# EAGLE design PCB-SLIDER60 (EAGLE 6.4)
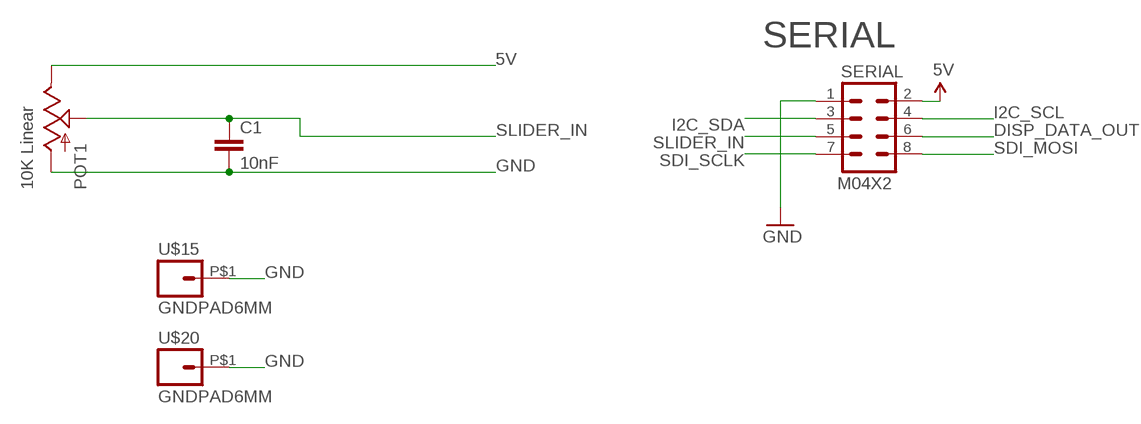
[diagram p0: schematic, sheet 1]

## Parts
C1  10nF  CAP0603-CAP  [0603-CAP]
POT1  10K Linear  SLIDER60  [SLIDER60]
SERIAL  M04X2  [2X4]
U$15  GNDPAD6MM  [3.2MMPAD6MM]
U$20  GNDPAD6MM  [3.2MMPAD6MM]

## Nets
5V [Power]: POT1.1(E) SERIAL.2
DISP_DATA_OUT: SERIAL.6
GND [Power]: C1.2 POT1.3(A) SERIAL.1 U$15.P$1 U$20.P$1
I2C_SCL: SERIAL.4
I2C_SDA: SERIAL.3
SDI_MOSI: SERIAL.8
SDI_SCLK: SERIAL.7
SLIDER_IN: C1.1 POT1.2A(S) SERIAL.5

## Notes on the sheet
- SERIAL

## Library data of the parts
C1 = SparkFun:CAP: Capacitor Standard 0603 ceramic capacitor, and 0.1" leaded capacitor.
POT1 = SKAARHOJ:SLIDER
SERIAL = SparkFun:M04X2
U$15 U$20 = SKAARHOJ:GNDPAD

## Net classes
0 default: width 0.203 mm, drill 0.406 mm, clearance 0.203 mm
1 Power: width 0.406 mm, drill 0.61 mm, clearance 0.203 mm

## Board
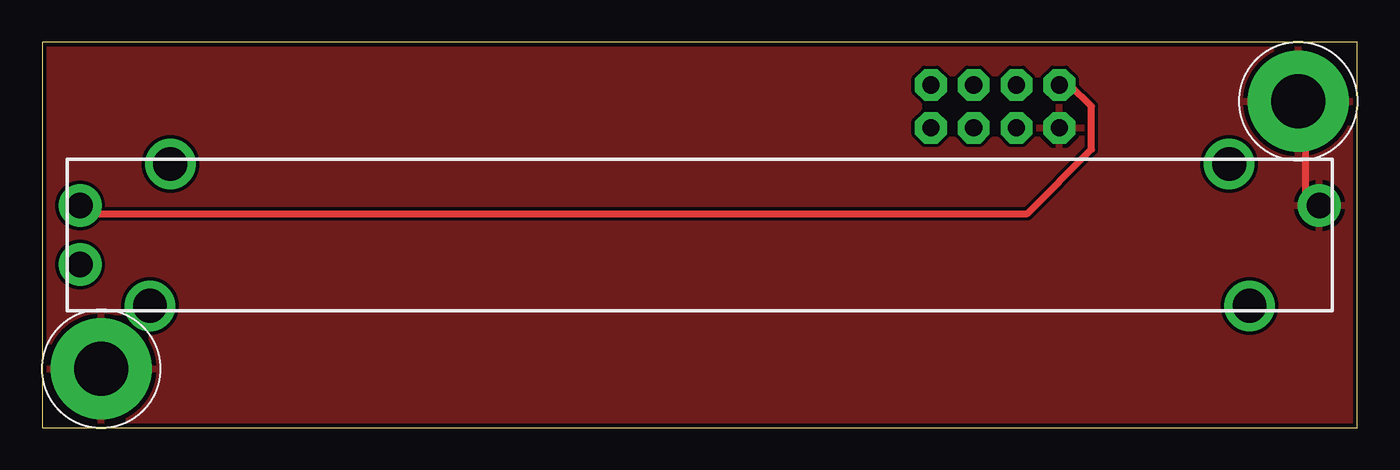
[diagram p1: board, top side]
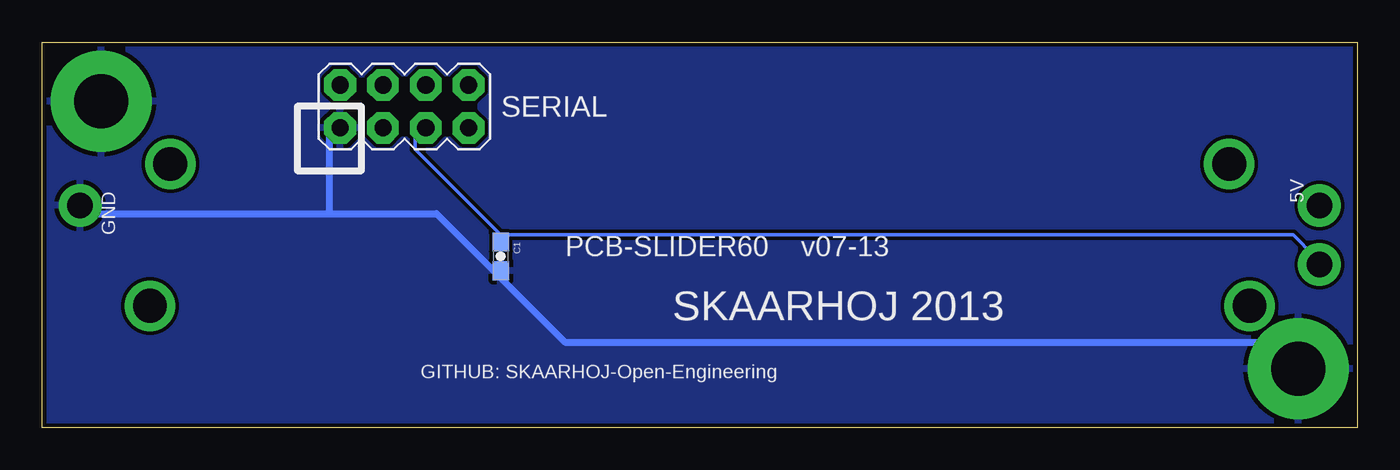
[diagram p2: board, bottom side, seen from below]

Size 78 x 22.86 mm. Coordinates in mm from the lower left corner, seen from the top.
Outline: 0,0 78,0 78,22.86 0,22.86 0,0
Copper layers (1*16): Top 0.035mm / dielectric 1.5mm / Bottom 0.035mm
Design rules "Fusion_eagle_rule_v1.1": minimum track width 6mil, minimum drill 12mil, track to track 6mil, track to pad 6mil, pad to pad 6mil, via to via 6mil, smd to smd 0mil, copper to edge 10mil, drill to drill 10mil, minimum pad ring 10mil, minimum via ring 6mil, stop-mask expansion 2mil, vias tented up to drill 100mil, thermal gap 10mil

### Footprints (pad centres in the part's own frame; a part is rotated, then mirrored left to right if it is on the bottom)
0603-CAP = smd 1.1 x 1: 1 -0.85,0; 2 0.85,0
SLIDER60 = drill 1.5 pad 2.54: 1 -36.75,1.75; 2A -36.75,-1.75; 3 36.75,1.75 | drill 2: P$1 -31.4,4.2; P$2 31.4,4.2; P$3 32.6,-4.2; P$4 -32.6,-4.2
2X4 = drill 1.016 pad 1.88 octagon: 1 -3.81,-1.27; 2 -3.81,1.27; 3 -1.27,-1.27; 4 -1.27,1.27; 5 1.27,-1.27; 6 1.27,1.27; 7 3.81,-1.27; 8 3.81,1.27
3.2MMPAD6MM = drill 3.2 pad 6: P$1 0,0

### Placement (x,y rotation side)
C1  50.8,10.16 270 bottom
POT1  39,11.43 0 top
SERIAL  56.52,19.05 0 bottom
U$15  3.5,3.5 0 top
U$20  74.5,19.36 0 top

### Tracks (layer width: path | path; a pad name or v marks a point on that pad's centre or on a via)
5V
  Top 0.406: SERIAL.2 60.96,20.32 62.23,19.05 62.23,16.51 58.42,12.7 2.54,12.7 POT1.1
GND
  Top 0.406: U$20.P$1 74.93,19.05 74.93,13.97 POT1.3
  Bottom 0.406: 50.8,8.89 54.61,12.7 60.96,12.7 | 60.96,12.7 74.93,12.7 POT1.3 | 60.96,12.7 60.96,17.78 SERIAL.1 | U$15.P$1 5.08,5.08 46.99,5.08 50.8,8.89 | 50.8,8.89 C1.2
  pour Top: 0,0 78.11,0 78.11,22.86 0,22.86
  pour Bottom: 0,0 78.11,0 78.11,22.86 0,22.86
SLIDER_IN
  Bottom 0.203: 50.8,11.43 55.88,16.51 55.88,17.78 SERIAL.5 | 50.8,11.43 3.81,11.43 2.54,10.16 POT1.2A | 50.8,11.43 C1.1

### Text on the board
_bsilk: 5V | GND | PCB-SLIDER60 v07-13 | SKAARHOJ 2013 | GITHUB: SKAARHOJ-Open-Engineering